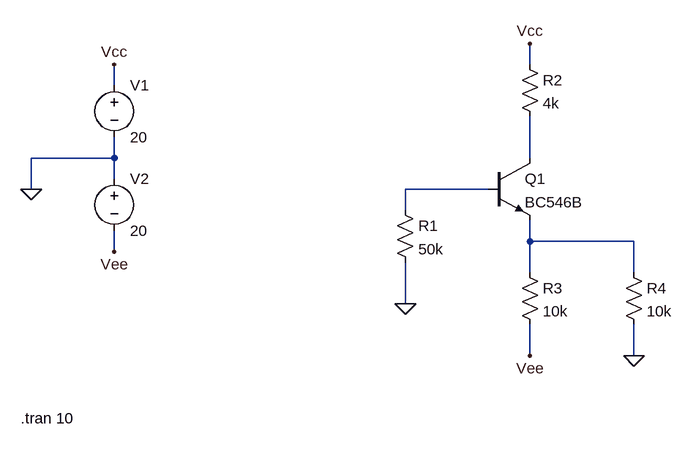
[diagram p0: schematic C-46.asc]
C-46.asc, the LTspice schematic file:
Version 4
SHEET 1 880 680
WIRE 192 -128 192 -160
WIRE -448 -96 -448 -128
WIRE -448 16 -448 -16
WIRE -448 16 -576 16
WIRE 192 16 192 -48
WIRE -448 48 -448 16
WIRE -576 64 -576 16
WIRE 128 64 0 64
WIRE 0 96 0 64
WIRE 192 144 192 112
WIRE 352 144 192 144
WIRE -448 160 -448 128
WIRE 192 192 192 144
WIRE 352 192 352 144
WIRE 0 240 0 176
WIRE 192 320 192 272
WIRE 352 320 352 272
FLAG -576 64 0
FLAG -448 -128 Vcc
FLAG -448 160 Vee
FLAG 352 320 0
FLAG 0 240 0
FLAG 192 320 Vee
FLAG 192 -160 Vcc
SYMBOL npn 128 16 R0
SYMATTR InstName Q1
SYMATTR Value BC546B
SYMBOL voltage -448 -112 R0
WINDOW 123 0 0 Left 0
WINDOW 39 0 0 Left 0
SYMATTR InstName V1
SYMATTR Value 20
SYMBOL voltage -448 32 R0
WINDOW 123 0 0 Left 0
WINDOW 39 0 0 Left 0
SYMATTR InstName V2
SYMATTR Value 20
SYMBOL res -16 80 R0
SYMATTR InstName R1
SYMATTR Value 50k
SYMBOL res 176 -144 R0
SYMATTR InstName R2
SYMATTR Value 4k
SYMBOL res 176 176 R0
SYMATTR InstName R3
SYMATTR Value 10k
SYMBOL res 336 176 R0
SYMATTR InstName R4
SYMATTR Value 10k
TEXT -592 416 Left 2 !.tran 10

The netlist it stands for:
* C-46.asc
Q1 N001 N002 N003 0 BC546B
V1 Vcc 0 20
V2 0 Vee 20
R1 N002 0 50k
R2 Vcc N001 4k
R3 N003 Vee 10k
R4 N003 0 10k
.model NPN NPN
.model PNP PNP
.lib standard.bjt
.tran 10
.backanno
.end